# Altium schematic sheet DEBUG.SchDoc
size 420 x 297 mm
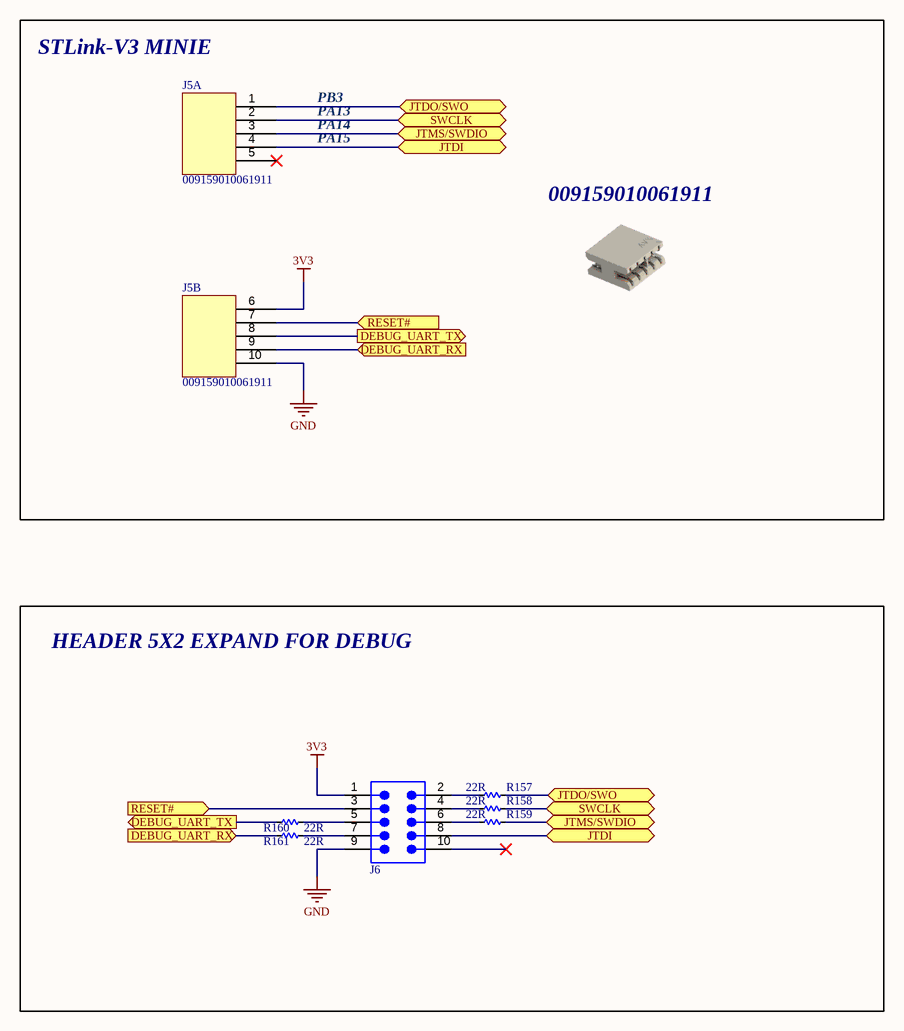
[diagram p0: DEBUG.SchDoc]

## Parts
J5  009159010061911  [009159010061911]  (parts A,B of 2)
J6  61301021121  [61301021121]  (value not drawn)
R157  22R  [RES_C_1608X60]
R158  22R  [RES_C_1608X60]
R159  22R  [RES_C_1608X60]
R160  22R  [RES_C_1608X60]
R161  22R  [RES_C_1608X60]

## Blocks framed on the sheet
HEADER 5X2 EXPAND FOR DEBUG: J6 R157-R161

## Ports
DEBUG_UART_RX (in), DEBUG_UART_TX (out), JTDI (bidir), JTDO/SWO (bidir), JTMS/SWDIO (bidir), RESET# (in), SWCLK (bidir)

## Nets
3V3: J5.6 J6.1
GND: J5.10 J6.9
DEBUG_UART_RX: J5.9 R161.1 ; port DEBUG_UART_RX
DEBUG_UART_TX: J5.8 R160.1 ; port DEBUG_UART_TX
JTDI: J5.4 J6.8 ; port JTDI
JTDO/SWO: J5.1 R157.2 ; port JTDO/SWO
JTMS/SWDIO: J5.3 R159.2 ; port JTMS/SWDIO
RESET#: J5.7 J6.3 ; port RESET#
SWCLK: J5.2 R158.2 ; port SWCLK
NetJ6_2: J6.2 R157.1
NetJ6_4: J6.4 R158.1
NetJ6_5: J6.5 R160.2
NetJ6_6: J6.6 R159.1
NetJ6_7: J6.7 R161.2

Not connected (* = marked no-connect by the designer): J5 5*; J6 10*

## Notes on the sheet
- STLink-V3 MINIE
- PB3
- PA13
- PA15
- PA14
- 009159010061911
- Sub-system:
- Design by:
- Sheet title:
- Project:
- Sheet:
- of
- Checked by:
- Approved by:
- Doc no:
- Revision:
- Size:
- Date:

## Library data of the parts
J5 = 009159010061911: pads for STLink V3 minie
J6 = 61301021121: WR-PHD Pin Header, THT, Vertical, pitch 2.54mm, 2 Row, 10P; Manufacturer: Wurth Elektronik; Contact Resistance: 20mOhm; Rated Current: 3A; Working Voltage: 250V; Withstanding Voltage: 500V; Manufacturer Part Number: 61301021121; Category: Board-to-Board Connectors; Match Code: WR-PHD; ComponentLink1Description: Website Link; ComponentLink1URL: https://www.we-online.com/redexpert/article/61301021121?ad; ComponentLink2Description: Datasheet Link; ComponentLink2URL: https://www.we-online.com/redexpert/spec/61301021121?ad; Mount: Through Hole; Operating Temperature Max: 105°C; Operating Temperature Min: -40°C; Packaging: Bag; Gender: Pin Header; Number of Pins: 10; Number of Rows: 2; Orientation: Vertical; Pitch: 2.54mm
R157-R161 = _RES_B_2: RES